# Altium schematic sheet MCU.SchDoc: MCU
size A3; Author: P.A.; CompanyName: STMicroelectronics; Organization: Microcontrollers Division; Address1: 12, Rue Jules HOROWITZ; Address2: 38019 Grenoble; Address3: FRANCE; DocumentNumber: MB1261; Revision: B.01; SheetNumber: 11; SheetTotal: 15; Project: STM32L496G-DISCO
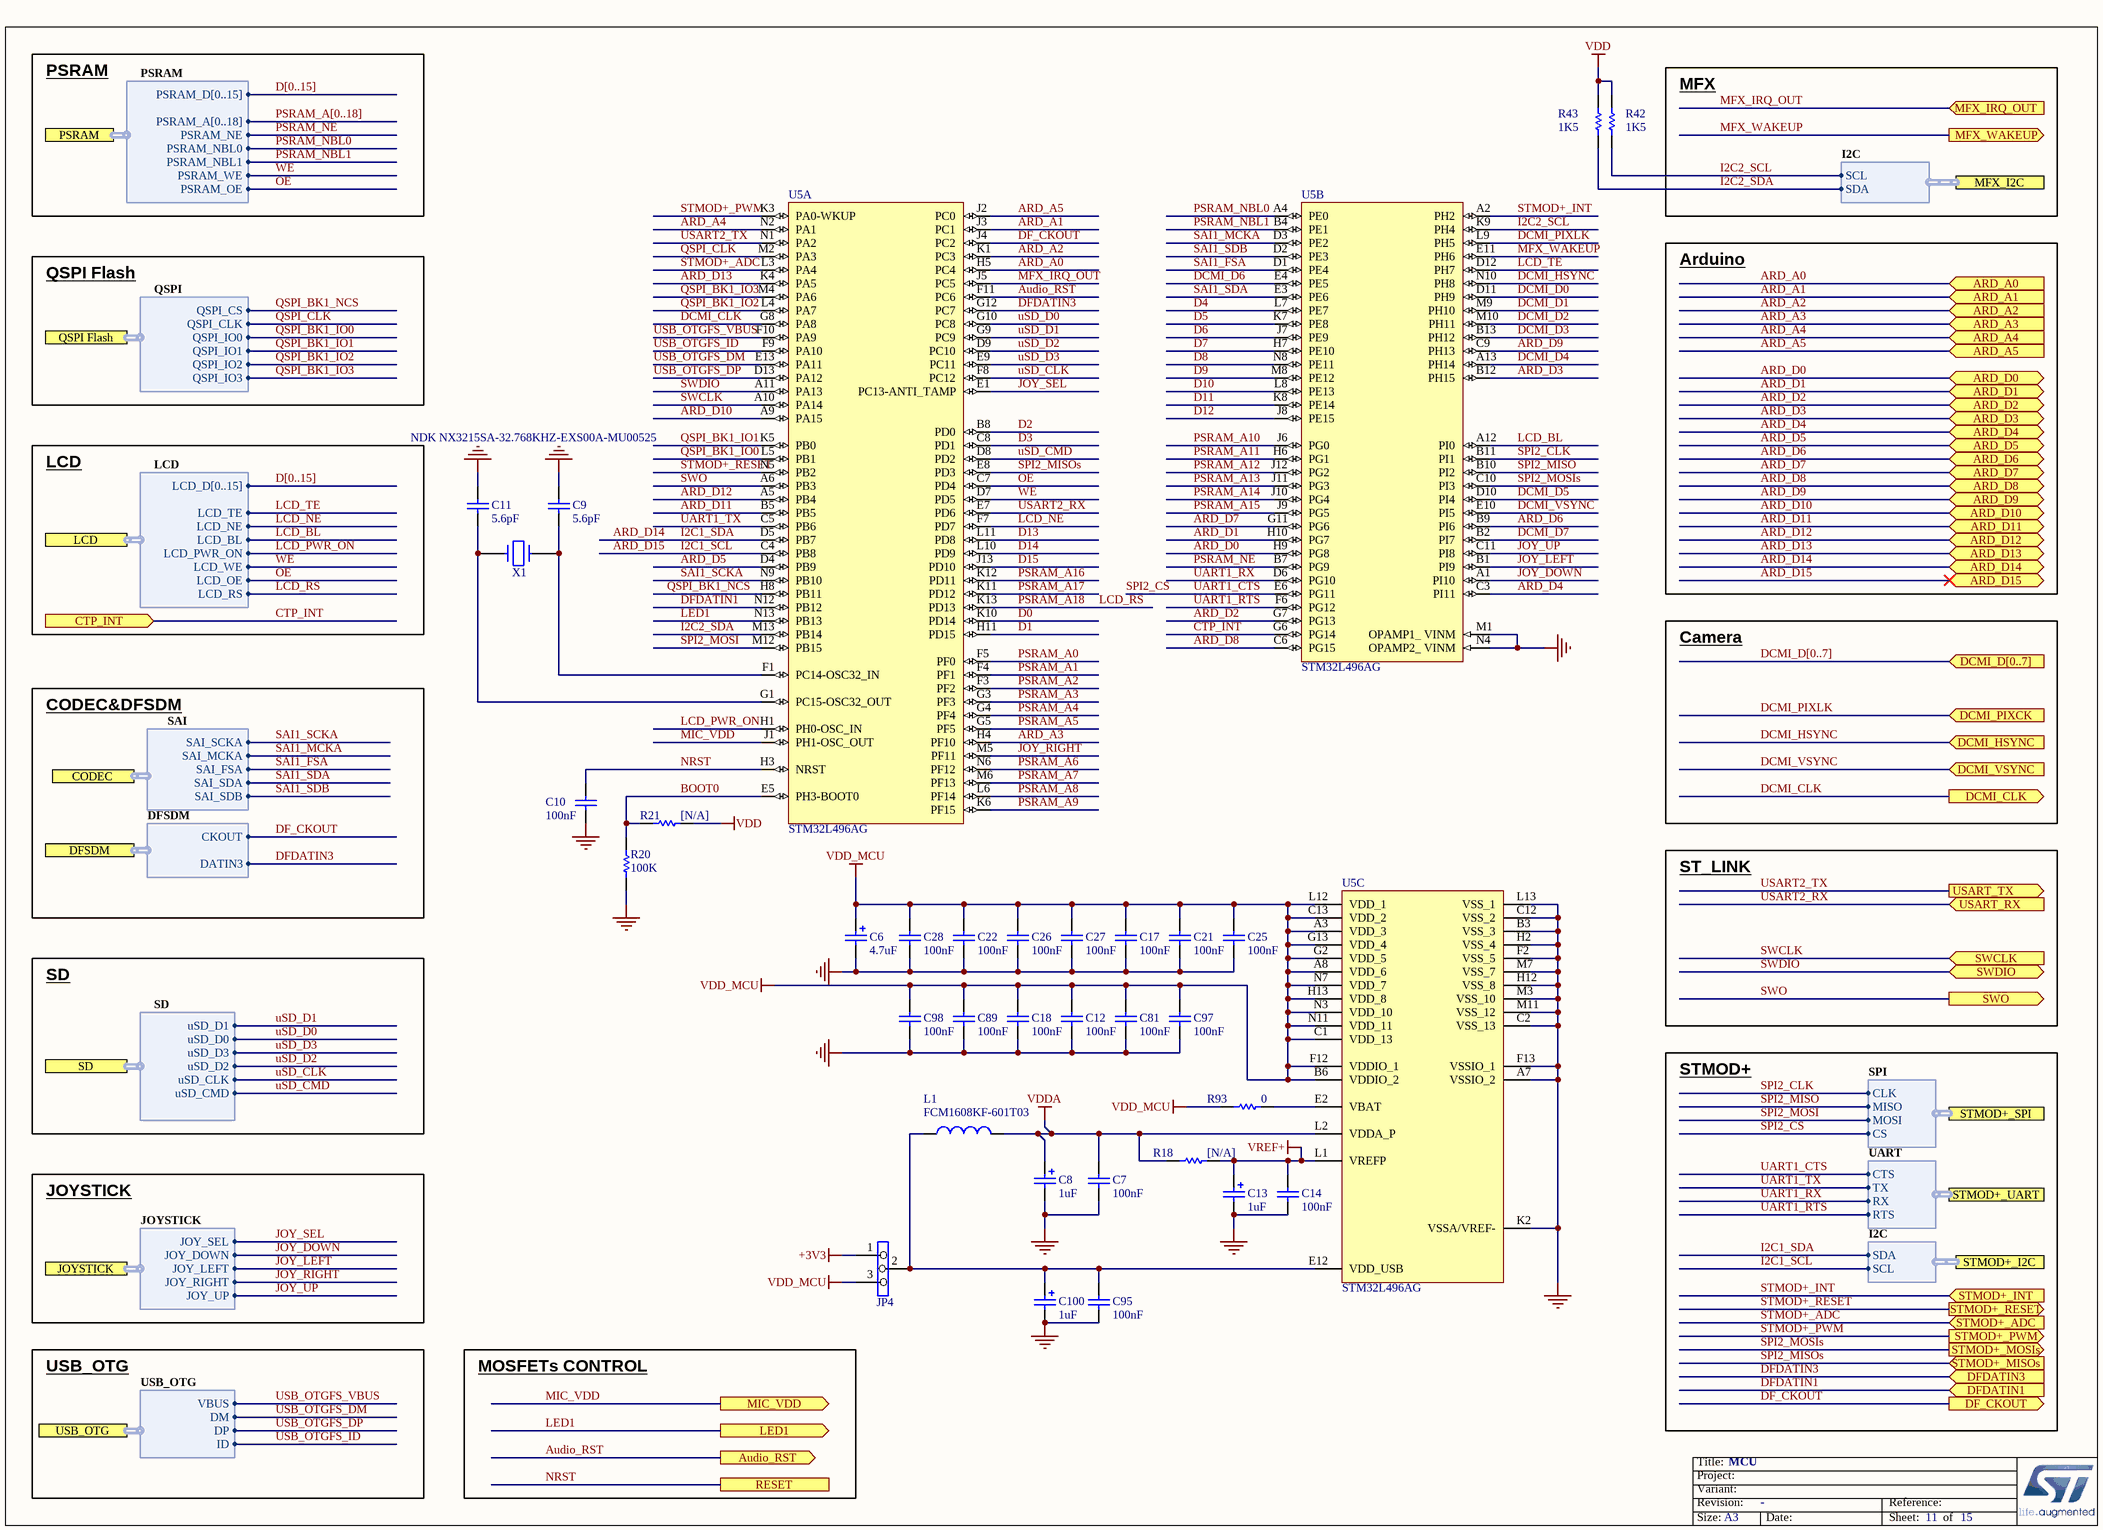
[diagram p0: MCU.SchDoc]

## Parts
C6  value 4.7uF  [TAN-A]  (hidden comment: TAJA475K016R)
C7  value 100nF  [0603C]  (hidden comment: CC0603KRX7R7BB104)
C8  value 1uF  [TAN-A]  (hidden comment: TAJA105K016R)
C9  5.6pF  [0603C]
C10  value 100nF  [0603C]  (hidden comment: CC0603KRX7R7BB104)
C11  5.6pF  [0603C]
C12  value 100nF  [0603C]  (hidden comment: CC0603KRX7R7BB104)
C13  value 1uF  [TAN-A]  (hidden comment: TAJA105K016R)
C14  value 100nF  [0603C]  (hidden comment: CC0603KRX7R7BB104)
C17  value 100nF  [0603C]  (hidden comment: CC0603KRX7R7BB104)
C18  value 100nF  [0603C]  (hidden comment: CC0603KRX7R7BB104)
C21  value 100nF  [0603C]  (hidden comment: CC0603KRX7R7BB104)
C22  value 100nF  [0603C]  (hidden comment: CC0603KRX7R7BB104)
C25  value 100nF  [0603C]  (hidden comment: CC0603KRX7R7BB104)
C26  value 100nF  [0603C]  (hidden comment: CC0603KRX7R7BB104)
C27  value 100nF  [0603C]  (hidden comment: CC0603KRX7R7BB104)
C28  value 100nF  [0603C]  (hidden comment: CC0603KRX7R7BB104)
C81  value 100nF  [0603C]  (hidden comment: CC0603KRX7R7BB104)
C89  value 100nF  [0603C]  (hidden comment: CC0603KRX7R7BB104)
C95  value 100nF  [0603C]  (hidden comment: CC0603KRX7R7BB104)
C97  value 100nF  [0603C]  (hidden comment: CC0603KRX7R7BB104)
C98  value 100nF  [0603C]  (hidden comment: CC0603KRX7R7BB104)
C100  value 1uF  [TAN-A]  (hidden comment: TAJA105K016R)
JP4  Jumper3  [SIP3]  (value not drawn)
L1  FCM1608KF-601T03  [0603L]
R18  [N/A]  [0603R]
R20  value 100K  [0603R]  (hidden comment: RC0603FR-07100KL)
R21  [N/A]  [0603R]
R42  value 1K5  [0603R]  (hidden comment: RC0603FR-071K5L)
R43  value 1K5  [0603R]  (hidden comment: RC0603FR-071K5L)
R93  value 0  [0603R]  (hidden comment: RC0603JR-070RL)
U5  STM32L496AG  [FBGA169_0R5_7X7]  (parts A,B,C of 3)
X1  NDK NX3215SA-32.768KHZ-EXS00A-MU00525  [XTAL_2SM_3R2X1R5]

## Ports
ARD_A0 (in), ARD_A1 (in), ARD_A2 (in), ARD_A3 (in), ARD_A4 (in), ARD_A5 (in), ARD_D0 (bidir), ARD_D1 (bidir), ARD_D2 (bidir), ARD_D3 (bidir), ARD_D4 (bidir), ARD_D5 (bidir), ARD_D6 (bidir), ARD_D7 (bidir), ARD_D8 (bidir), ARD_D9 (bidir), ARD_D10 (bidir), ARD_D11 (bidir), ARD_D12 (bidir), ARD_D13 (bidir), ARD_D14 (bidir), ARD_D15 (bidir), Audio_RST (out), CODEC (harness SAI), CTP_INT (in), DCMI_CLK (out), DCMI_D[0..7] (in), DCMI_HSYNC (in), DCMI_PIXCK (in), DCMI_VSYNC (in), DF_CKOUT (out), DFDATIN1 (in), DFDATIN3 (in), DFSDM (harness DFSDM), JOYSTICK (harness JOYSTICK), LCD (harness LCD), LED1 (out), MFX_I2C (harness I2C), MFX_IRQ_OUT (in), MFX_WAKEUP (out), MIC_VDD (out), PSRAM (harness PSRAM), QSPI Flash (harness QSPI), RESET, SD (harness SD), STMOD+_ADC (in), STMOD+_I2C (harness I2C), STMOD+_INT (in), STMOD+_MISOs (in), STMOD+_MOSIs (out), STMOD+_PWM (out), STMOD+_RESET (out), STMOD+_SPI (harness SPI), STMOD+_UART (harness UART), SWCLK (in), SWDIO (bidir), SWO (out), USART_RX (in), USART_TX (out), USB_OTG (harness USB_OTG)

## Harnesses
QSPI: QSPI_IO1, QSPI_IO0, QSPI_CLK, QSPI_CS, QSPI_IO2, QSPI_IO3
PSRAM: PSRAM_A[0..18], PSRAM_NE, PSRAM_NBL0, PSRAM_WE, PSRAM_OE, PSRAM_D[0..15], PSRAM_NBL1
LCD: LCD_NE, LCD_BL, LCD_WE, LCD_OE, LCD_D[0..15], LCD_RS, LCD_PWR_ON, LCD_TE
SAI: SAI_SDB, SAI_FSA, SAI_MCKA, SAI_SDA, SAI_SCKA
DFSDM: DATIN3, CKOUT
SD: uSD_D0, uSD_CLK, uSD_D1, uSD_D2, uSD_D3, uSD_CMD
JOYSTICK: JOY_SEL, JOY_DOWN, JOY_LEFT, JOY_RIGHT, JOY_UP
USB_OTG: VBUS, DM, DP, ID
I2C: SDA, SCL
SPI: MISO, MOSI, CLK, CS
UART: RX, TX, RTS, CTS

## Nets
+3V3: JP4.1
GND: C6.2 C7.2 C8.2 C9.1 C10.2 C11.1 C12.2 C13.2 C14.2 C17.2 C18.2 C21.2 C22.2 C25.2 C26.2 C27.2 C28.2 C81.2 C89.2 C95.2 C97.2 C98.2 C100.2 R20.1 U5.A7(VSSIO_2) U5.B3(VSS_3) U5.C2(VSS_13) U5.C12(VSS_2) U5.F2(VSS_5) U5.F13(VSSIO_1) U5.H2(VSS_4) U5.H12(VSS_8) U5.K2(VSSA/VREF-) U5.L13(VSS_1) U5.M1(OPAMP1__VINM) U5.M3(VSS_10) U5.M7(VSS_7) U5.M11(VSS_12) U5.N4(OPAMP2__VINM)
VDD: R21.1 R42.1 R43.1
VDD_MCU: C6.1 C12.1 C17.1 C18.1 C21.1 C22.1 C25.1 C26.1 C27.1 C28.1 C81.1 C89.1 C97.1 C98.1 JP4.3 R93.2 U5.A3(VDD_3) U5.A8(VDD_6) U5.B6(VDDIO_2) U5.C1(VDD_13) U5.C13(VDD_2) U5.F12(VDDIO_1) U5.G2(VDD_5) U5.G13(VDD_4) U5.H13(VDD_8) U5.L12(VDD_1) U5.N3(VDD_10) U5.N7(VDD_7) U5.N11(VDD_11)
VDDA: C7.1 C8.1 L1.2 R18.2 U5.L2(VDDA_P)
VREF+: C13.1 C14.1 R18.1 U5.L1(VREFP)
ARD_A0: U5.H5(PC4) ; port ARD_A0
ARD_A1: U5.J3(PC1) ; port ARD_A1
ARD_A2: U5.K1(PC3) ; port ARD_A2
ARD_A3: U5.H4(PF10) ; port ARD_A3
ARD_A4: U5.N2(PA1) ; port ARD_A4
ARD_A5: U5.J2(PC0) ; port ARD_A5
ARD_D0: U5.H9(PG8) ; port ARD_D0
ARD_D1: U5.H10(PG7) ; port ARD_D1
ARD_D2: U5.G7(PG13) ; port ARD_D2
ARD_D3: U5.B12(PH15) ; port ARD_D3
ARD_D4: U5.C3(PI11) ; port ARD_D4
ARD_D5: U5.D4(PB9) ; port ARD_D5
ARD_D6: U5.B9(PI6) ; port ARD_D6
ARD_D7: U5.G11(PG6) ; port ARD_D7
ARD_D8: U5.C6(PG15) ; port ARD_D8
ARD_D9: U5.C9(PH13) ; port ARD_D9
ARD_D10: U5.A9(PA15) ; port ARD_D10
ARD_D11: U5.B5(PB5) ; port ARD_D11
ARD_D12: U5.A5(PB4) ; port ARD_D12
ARD_D13: U5.K4(PA5) ; port ARD_D13
ARD_D14: U5.D5(PB7) ; port ARD_D14, port STMOD+_I2C.SDA  [also labelled I2C1_SDA]
ARD_D15: U5.C4(PB8) ; port ARD_D15, port STMOD+_I2C.SCL  [also labelled I2C1_SCL]
Audio_RST: U5.F11(PC6) ; port Audio_RST
BOOT0: R20.2 R21.2 U5.E5(PH3-BOOT0)
CTP_INT: U5.G6(PG14) ; port CTP_INT
D0: U5.K10(PD14)
D1: U5.H11(PD15)
D2: U5.B8(PD0)
D3: U5.C8(PD1)
D4: U5.L7(PE7)
D5: U5.K7(PE8)
D6: U5.J7(PE9)
D7: U5.H7(PE10)
D8: U5.N8(PE11)
D9: U5.M8(PE12)
D10: U5.L8(PE13)
D11: U5.K8(PE14)
D12: U5.J8(PE15)
D13: U5.L11(PD8)
D14: U5.L10(PD9)
D15: U5.J13(PD10)
DCMI_CLK: U5.G8(PA8) ; port DCMI_CLK
DCMI_D0: U5.D11(PH9)
DCMI_D1: U5.M9(PH10)
DCMI_D2: U5.M10(PH11)
DCMI_D3: U5.B13(PH12)
DCMI_D4: U5.A13(PH14)
DCMI_D5: U5.D10(PI4)
DCMI_D6: U5.E4(PE5)
DCMI_D7: U5.B2(PI7)
DCMI_HSYNC: U5.N10(PH8) ; port DCMI_HSYNC
DCMI_PIXLK: U5.L9(PH5) ; port DCMI_PIXCK
DCMI_VSYNC: U5.E10(PI5) ; port DCMI_VSYNC
DF_CKOUT: U5.J4(PC2) ; port DF_CKOUT, port DFSDM.CKOUT
DFDATIN1: U5.N12(PB12) ; port DFDATIN1
DFDATIN3: U5.G12(PC7) ; port DFDATIN3, port DFSDM.DATIN3
I2C2_SCL: R42.2 U5.K9(PH4) ; port MFX_I2C.SCL
I2C2_SDA: R43.2 U5.M13(PB14) ; port MFX_I2C.SDA
JOY_DOWN: U5.A1(PI10) ; port JOYSTICK.JOY_DOWN
JOY_LEFT: U5.B1(PI9) ; port JOYSTICK.JOY_LEFT
JOY_RIGHT: U5.M5(PF11) ; port JOYSTICK.JOY_RIGHT
JOY_SEL: U5.E1(PC13-ANTI_TAMP) ; port JOYSTICK.JOY_SEL
JOY_UP: U5.C11(PI8) ; port JOYSTICK.JOY_UP
LCD_BL: U5.A12(PI0) ; port LCD.LCD_BL
LCD_NE: U5.F7(PD7) ; port LCD.LCD_NE
LCD_PWR_ON: U5.H1(PH0-OSC_IN) ; port LCD.LCD_PWR_ON
LCD_RS: U5.K13(PD13) ; port LCD.LCD_RS  [also labelled PSRAM_A18]
LCD_TE: U5.D12(PH7) ; port LCD.LCD_TE
LED1: U5.N13(PB13) ; port LED1
MFX_IRQ_OUT: U5.J5(PC5) ; port MFX_IRQ_OUT
MFX_WAKEUP: U5.E11(PH6) ; port MFX_WAKEUP
MIC_VDD: U5.J1(PH1-OSC_OUT) ; port MIC_VDD
NRST: C10.1 U5.H3(NRST) ; port RESET
OE: U5.C7(PD4) ; port PSRAM.PSRAM_OE, port LCD.LCD_OE
PSRAM_A0: U5.F5(PF0)
PSRAM_A1: U5.F4(PF1)
PSRAM_A2: U5.F3(PF2)
PSRAM_A3: U5.G3(PF3)
PSRAM_A4: U5.G4(PF4)
PSRAM_A5: U5.G5(PF5)
PSRAM_A6: U5.N6(PF12)
PSRAM_A7: U5.M6(PF13)
PSRAM_A8: U5.L6(PF14)
PSRAM_A9: U5.K6(PF15)
PSRAM_A10: U5.J6(PG0)
PSRAM_A11: U5.H6(PG1)
PSRAM_A12: U5.J12(PG2)
PSRAM_A13: U5.J11(PG3)
PSRAM_A14: U5.J10(PG4)
PSRAM_A15: U5.J9(PG5)
PSRAM_A16: U5.K12(PD11)
PSRAM_A17: U5.K11(PD12)
PSRAM_NBL0: U5.A4(PE0) ; port PSRAM.PSRAM_NBL0
PSRAM_NBL1: U5.B4(PE1) ; port PSRAM.PSRAM_NBL1
PSRAM_NE: U5.B7(PG9) ; port PSRAM.PSRAM_NE
QSPI_BK1_IO0: U5.L5(PB1) ; port QSPI Flash.QSPI_IO0
QSPI_BK1_IO1: U5.K5(PB0) ; port QSPI Flash.QSPI_IO1
QSPI_BK1_IO2: U5.L4(PA7) ; port QSPI Flash.QSPI_IO2
QSPI_BK1_IO3: U5.M4(PA6) ; port QSPI Flash.QSPI_IO3
QSPI_BK1_NCS: U5.H8(PB11) ; port QSPI Flash.QSPI_CS
QSPI_CLK: U5.M2(PA3) ; port QSPI Flash.QSPI_CLK
SAI1_FSA: U5.D1(PE4) ; port CODEC.SAI_FSA
SAI1_MCKA: U5.D3(PE2) ; port CODEC.SAI_MCKA
SAI1_SCKA: U5.N9(PB10) ; port CODEC.SAI_SCKA
SAI1_SDA: U5.E3(PE6) ; port CODEC.SAI_SDA
SAI1_SDB: U5.D2(PE3) ; port CODEC.SAI_SDB
SPI2_CLK: U5.B11(PI1) ; port STMOD+_SPI.CLK
SPI2_CS: U5.E6(PG11) ; port STMOD+_SPI.CS, port STMOD+_UART.CTS  [also labelled UART1_CTS]
SPI2_MISO: U5.B10(PI2) ; port STMOD+_SPI.MISO
SPI2_MISOs: U5.E8(PD3) ; port STMOD+_MISOs
SPI2_MOSI: U5.M12(PB15) ; port STMOD+_SPI.MOSI
SPI2_MOSIs: U5.C10(PI3) ; port STMOD+_MOSIs
STMOD+_ADC: U5.L3(PA4) ; port STMOD+_ADC
STMOD+_INT: U5.A2(PH2) ; port STMOD+_INT
STMOD+_PWM: U5.K3(PA0-WKUP) ; port STMOD+_PWM
STMOD+_RESET: U5.N5(PB2) ; port STMOD+_RESET
SWCLK: U5.A10(PA14) ; port SWCLK
SWDIO: U5.A11(PA13) ; port SWDIO
SWO: U5.A6(PB3) ; port SWO
UART1_RTS: U5.F6(PG12) ; port STMOD+_UART.RTS
UART1_RX: U5.D6(PG10) ; port STMOD+_UART.RX
UART1_TX: U5.C5(PB6) ; port STMOD+_UART.TX
USART2_RX: U5.E7(PD6) ; port USART_RX
USART2_TX: U5.N1(PA2) ; port USART_TX
USB_OTGFS_DM: U5.E13(PA11) ; port USB_OTG.DM
USB_OTGFS_DP: U5.D13(PA12) ; port USB_OTG.DP
USB_OTGFS_ID: U5.F9(PA10) ; port USB_OTG.ID
USB_OTGFS_VBUS: U5.F10(PA9) ; port USB_OTG.VBUS
uSD_CLK: U5.F8(PC12) ; port SD.uSD_CLK
uSD_CMD: U5.D8(PD2) ; port SD.uSD_CMD
uSD_D0: U5.G10(PC8) ; port SD.uSD_D0
uSD_D1: U5.G9(PC9) ; port SD.uSD_D1
uSD_D2: U5.D9(PC10) ; port SD.uSD_D2
uSD_D3: U5.E9(PC11) ; port SD.uSD_D3
WE: U5.D7(PD5) ; port PSRAM.PSRAM_WE, port LCD.LCD_WE
NetC9_2: C9.2 U5.F1(PC14-OSC32_IN) X1.1
NetC11_2: C11.2 U5.G1(PC15-OSC32_OUT) X1.2
NetC95_1: C95.1 C100.1 JP4.2 L1.1 U5.E12(VDD_USB)
NetR93_1: R93.1 U5.E2(VBAT)

## Buses and harness runs
bus D[0..15]
bus DCMI_D[0..7] = port DCMI_D[0..7]
bus PSRAM_A[0..18]

## Notes on the sheet
- PSRAM
- MFX
- Arduino
- QSPI Flash
- LCD
- Camera
- CODEC&DFSDM
- ST_LINK
- SD
- STMOD+
- JOYSTICK
- USB_OTG
- MOSFETs CONTROL
- Title:
- Project:
- Size:
- Revision:
- Variant:
- A3
- -
- Date:
- Reference:
- Sheet:
- of

## Library data of the parts
C6 = Cap Pol1: TAN Capacitor,4.7uF,10%,16V,A Type,AVX; Ordered by: Subcon; ECCN_US/EU: NA; Published: 8-Jun-2000; Revision: July-2002: Re-released for DXP Platform.; Publisher: Altium Limited; Manuf_1: AVX; Manuf_Part_1: TAJA475K016R
C7 C10 C12 C14 C17 C18 C21 C22 C25-C28 C81 C89 C95 C97 C98 = Cap: Capacitor,100nF,10%,16V,X7R,0603,YAGEO; Ordered by: Subcon; Published: 8-Jun-2000; Revision: July-2002: Re-released for DXP Platform.; Publisher: Altium Limited; Manuf_1: YAGEO; Manuf_Part_1: CC0603KRX7R7BB104
C8 C13 C100 = Cap Pol1: Tan Capacitor,1uF,10%,16V,Tan-A,TAJA105K016R; Manuf_1: AVX; Ordered by: Subcon; ECCN_US/EU: NA; Published: 8-Jun-2000; Revision: July-2002: Re-released for DXP Platform.; Publisher: Altium Limited; Manuf_Part_1: TAJA105K016R
C9 C11 = Cap: Capacitor,5.6pF,0.25P,50V,NPO,0603; Manuf_1: YAGEO; Ordered by: Subcon; Published: 8-Jun-2000; Revision: July-2002: Re-released for DXP Platform.; Publisher: Altium Limited; Value: 5.6pF
JP4 = Jumper3: Manuf_1: lyconn; Manuf_Part_1: 313103S111116; Ordered by: Subcon; ECCN_US/EU: NA
L1 = Inductor: 100uH Bead; Manuf_1: Tai-tech; Ordered by: Subcon; ECCN_US/EU: NA; Published: 8-Jun-2000; Revision: July-2002: Re-released for DXP Platform.; Publisher: Altium Limited; Value: 100uH; Manuf_Part_1: FCM1608KF-601T03
R18 = res1: Resistor, 0 ,0603,1%,YAGEO; Manuf_Part_1: RC0603JR-070RL; Value: 0; Ordered by: Subcon; ECCN_US/EU: NA; Published: 8-Jun-2000; Revision: July-2002: Re-released for DXP Platform.; Publisher: Altium Limited; Manuf_1: YAGEO
R20 = res1: Resistor,100K,0603,1%,YAGEO; Ordered by: Subcon; ECCN_US/EU: NA; Published: 8-Jun-2000; Revision: July-2002: Re-released for DXP Platform.; Publisher: Altium Limited; Manuf_1: YAGEO; Manuf_Part_1: RC0603FR-07100KL
R21 = res1: Resistor,100K,0603,1%,YAGEO; Manuf_Part_1: RC0603FR-07100KL; Ordered by: Subcon; ECCN_US/EU: NA; Published: 8-Jun-2000; Revision: July-2002: Re-released for DXP Platform.; Publisher: Altium Limited; Value: 100K; Manuf_1: YAGEO
R42 R43 = res1: Resistor,1.5K,0603,1%,YAGEO; Ordered by: Subcon; ECCN_US/EU: NA; Published: 8-Jun-2000; Revision: July-2002: Re-released for DXP Platform.; Publisher: Altium Limited; Manuf_1: YAGEO; Manuf_Part_1: RC0603FR-071K5L
R93 = res1: Resistor, 0 ,0603,1%,YAGEO; Ordered by: Subcon; ECCN_US/EU: NA; Published: 8-Jun-2000; Revision: July-2002: Re-released for DXP Platform.; Publisher: Altium Limited; Manuf_1: YAGEO; Manuf_Part_1: RC0603JR-070RL
U5 = STM32L496G: Ordered by: STM; Ref St: TBD; ECCN_US/EU: 3A991A2/NEC; Manuf_1: STM; Manuf_Part_1: STM32L496AG
X1 = CRYSTAL_32K: 32.768kHz Crystal; Ordered by: STM; ECCN_US/EU: EAR99/NEC; Ref St: 9157034; Manuf_1: NDK; Manuf_Part_1: NX3215SA-32.768KHZ-EXS00A-MU00525